# EAGLE design CMC_PPG (EAGLE 9.1.2)
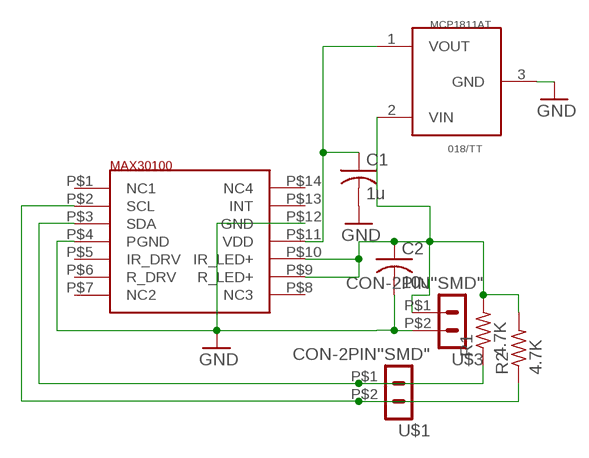
[diagram p0: schematic, sheet 1]

## Parts
C1  1u  C-USC0805  [C0805]
C2  10u  C-USC0805  [C0805]
R1  4.7K  R-US_R0603  [R0603]
R2  4.7K  R-US_R0603  [R0603]
U$1  CON-2PIN''SMD"  [CON-2PINSMD]
U$2  OPTO_OXI_MAX30100  [OPTO_OXI_MAX30100]
U$3  CON-2PIN''SMD"  [CON-2PINSMD]
U$4  MCP1811AT-018/TTSMD  [SOT23-3]

## Nets
GND: C1.2 C2.2 U$2.P$4(PGND) U$2.P$12(GND) U$3.P$2 U$4.3(GND)
N$1: C1.1 U$2.P$11(VDD) U$4.1(VOUT)
SCL: R2.1 U$1.P$2 U$2.P$2(SCL)
SDA: R1.1 U$1.P$1 U$2.P$3(SDA)
VDD: C2.1 R1.2 R2.2 U$2.P$9(R_LED+) U$2.P$10(IR_LED+) U$3.P$1 U$4.2(VIN)
Unconnected: U$2.P$1(NC1) U$2.P$5(IR_DRV) U$2.P$6(R_DRV) U$2.P$7(NC2) U$2.P$8(NC3) U$2.P$13(INT) U$2.P$14(NC4)

## Library data of the parts
C1 C2 = rcl:C-US: CAPACITOR, American symbol; SPICEPREFIX: C
R1 R2 = rcl@1:R-US_: RESISTOR, American symbol
U$1 U$3 = CMCbioengg:CON-2PIN
U$2 = surdev:OPTO_OXI_MAX30100
U$4 = PPG_MCP18:MCP1811AT-018/TT

## Board
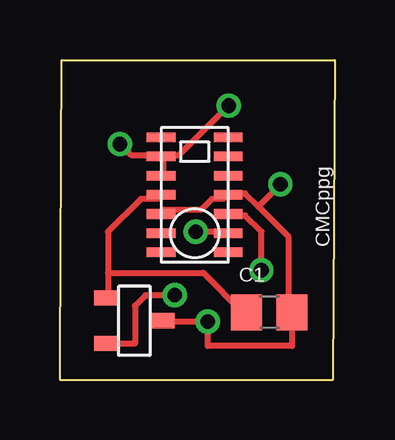
[diagram p1: board, top side]
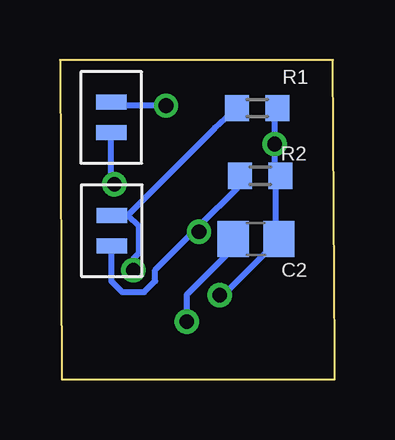
[diagram p2: board, bottom side, seen from below]

Size 11.46 x 13.34 mm. Coordinates in mm from the lower left corner, seen from the top.
Outline: 0,1 0.08,13.34 11.46,13.34 11.39,0.04
Outline: 0,0.04 0,1.5
Outline: 0.01,0 11.39,0
Copper layers (1*16): Top 0.035mm / dielectric 1.5mm / Bottom 0.035mm
Design rules "default *": minimum track width 10mil, minimum drill 24mil, track to track 8mil, track to pad 8mil, pad to pad 8mil, via to via 8mil, smd to smd 6mil, copper to edge 40mil, drill to drill 8mil, minimum pad ring 10mil, minimum via ring 8mil, stop-mask expansion 4mil, vias tented up to drill 0mil, thermal gap 10mil

### Footprints (pad centres in the part's own frame; a part is rotated, then mirrored left to right if it is on the bottom)
C0805 = smd 1.3 x 1.5: 1 -0.95,0; 2 0.95,0
R0603 = smd 1 x 1.1: 1 -0.85,0; 2 0.85,0
CON-2PINSMD = smd 1.27 x 0.635: P$1 0,1.27; P$2 0,0
OPTO_OXI_MAX30100 = smd 1.2 x 0.4: P$1 -1.4,2.6; P$2 -1.4,1.8; P$3 -1.4,1; P$4 -1.4,0.2; P$5 -1.4,-0.6; P$6 -1.4,-1.4; P$7 -1.4,-2.2; P$8 1.4,-2.2; P$9 1.4,-1.4; P$10 1.4,-0.6; P$11 1.4,0.2; P$12 1.4,1; P$13 1.4,1.8; P$14 1.4,2.6
SOT23-3 = smd 0.635 x 1.05: 1 -0.95,-1.15; 2 0.95,-1.15; 3 0,1.15

### Placement (x,y rotation side)
C1  8.73,2.82 0 top
C2  3.28,5.87 180 bottom
R1  3.23,11.33 0 bottom
R2  3.11,8.5 0 bottom
U$1  9.3,5.58 0 bottom
U$2  5.62,7.91 180 top
U$3  9.33,10.31 0 bottom
U$4  3.1,2.46 270 top

### Tracks (layer width: path | path; a pad name or v marks a point on that pad's centre or on a via)
GND  (via drill 0.61)
  Top 0.254: U$2.P$12 4.29,7.09 5.89,7.09 6.35,7.55 6.81,7.55 U$2.P$4 7.04,7.77 7.72,7.77 8.27,7.22 | 8.27,7.22 v9.2,8.15 | U$4.3 4.25,2.42 v6.17,2.42 6.17,1.41 9.68,1.41 C1.2 9.55,2.87 9.55,5.94 8.27,7.22
  Bottom 0.254: v9.2,8.15 9.32,8.27 9.32,10.29 U$3.P$2 | v6.17,2.42 6.17,3.55 4.48,5.24 4.48,5.67 C2.2
N$1
  Top 0.254: 2.01,4.46 2.01,6.17 3.38,7.55 4.06,7.55 U$2.P$11 | 2.01,4.46 2.01,3.42 U$4.1 | C1.1 7.62,2.82 5.98,4.46 2.01,4.46
SCL  (via drill 0.61)
  Top 0.254: v5.66,6.17 6.81,6.17 U$2.P$2
  Bottom 0.254: 5.66,6.4 7.49,4.57 7.49,4.12 7.95,3.66 8.86,3.66 9.32,4.12 9.32,5.49 U$1.P$2 | 5.66,6.4 4.06,8 4.06,8.11 R2.1 | 5.66,6.4 v5.66,6.17
SDA  (via drill 0.61)
  Top 0.254: v8.41,4.57 8.41,6.17 7.72,6.86 7.04,6.86 U$2.P$3
  Bottom 0.254: 8.64,6.86 5,10.5 R1.1 | 8.64,6.86 9.09,6.86 U$1.P$1 | v8.41,4.57 8.41,5.03 8.18,5.26 8.18,6.4 8.64,6.86
VDD  (via drill 0.61)
  Top 0.254: U$2.P$10 4.29,8.69 4.29,9.15 U$2.P$9 | v7.04,11.43 4.98,9.37 4.29,9.37 U$2.P$9 | U$4.2 3.13,1.51 3.13,3.09 3.57,3.52 v4.8,3.52 | v2.51,9.83 2.96,9.37 4.06,9.37 U$2.P$9
  Bottom 0.254: 2.38,5.87 C2.1 | v7.04,11.43 9.32,11.43 U$3.P$1 | v4.8,3.52 4.66,3.52 2.46,5.72 C2.1 | C2.1 2.46,5.94 2.46,8.29 R2.2 2.51,8.64 v2.51,9.83 2.51,11.04 R1.2

### Text on the board
tNames: CMCppg